# Altium schematic sheet 2CH_PM_Simulator.SchDoc: Title
size 420 x 297 mm; EDA_Number: ARTIQ; Author: G.Kasprowicz; CompanyName: WUT ISE; DrawnBy: G.Kasprowicz; Organization: WUT ISE; Address1: PW ISE; Address2: Nowowiejska 15/19 00-665 Warsaw; Address3: gkasprow@gmail.com; Revision: 2; SheetNumber: -; SheetTotal: -; ModifiedBy: -; CheckedDate: -; Title2: Title 2; DivGrp: WUT ISE; Designer: G.Kasprowicz; ModifiedDate: -; ProjectName: Sensor Box
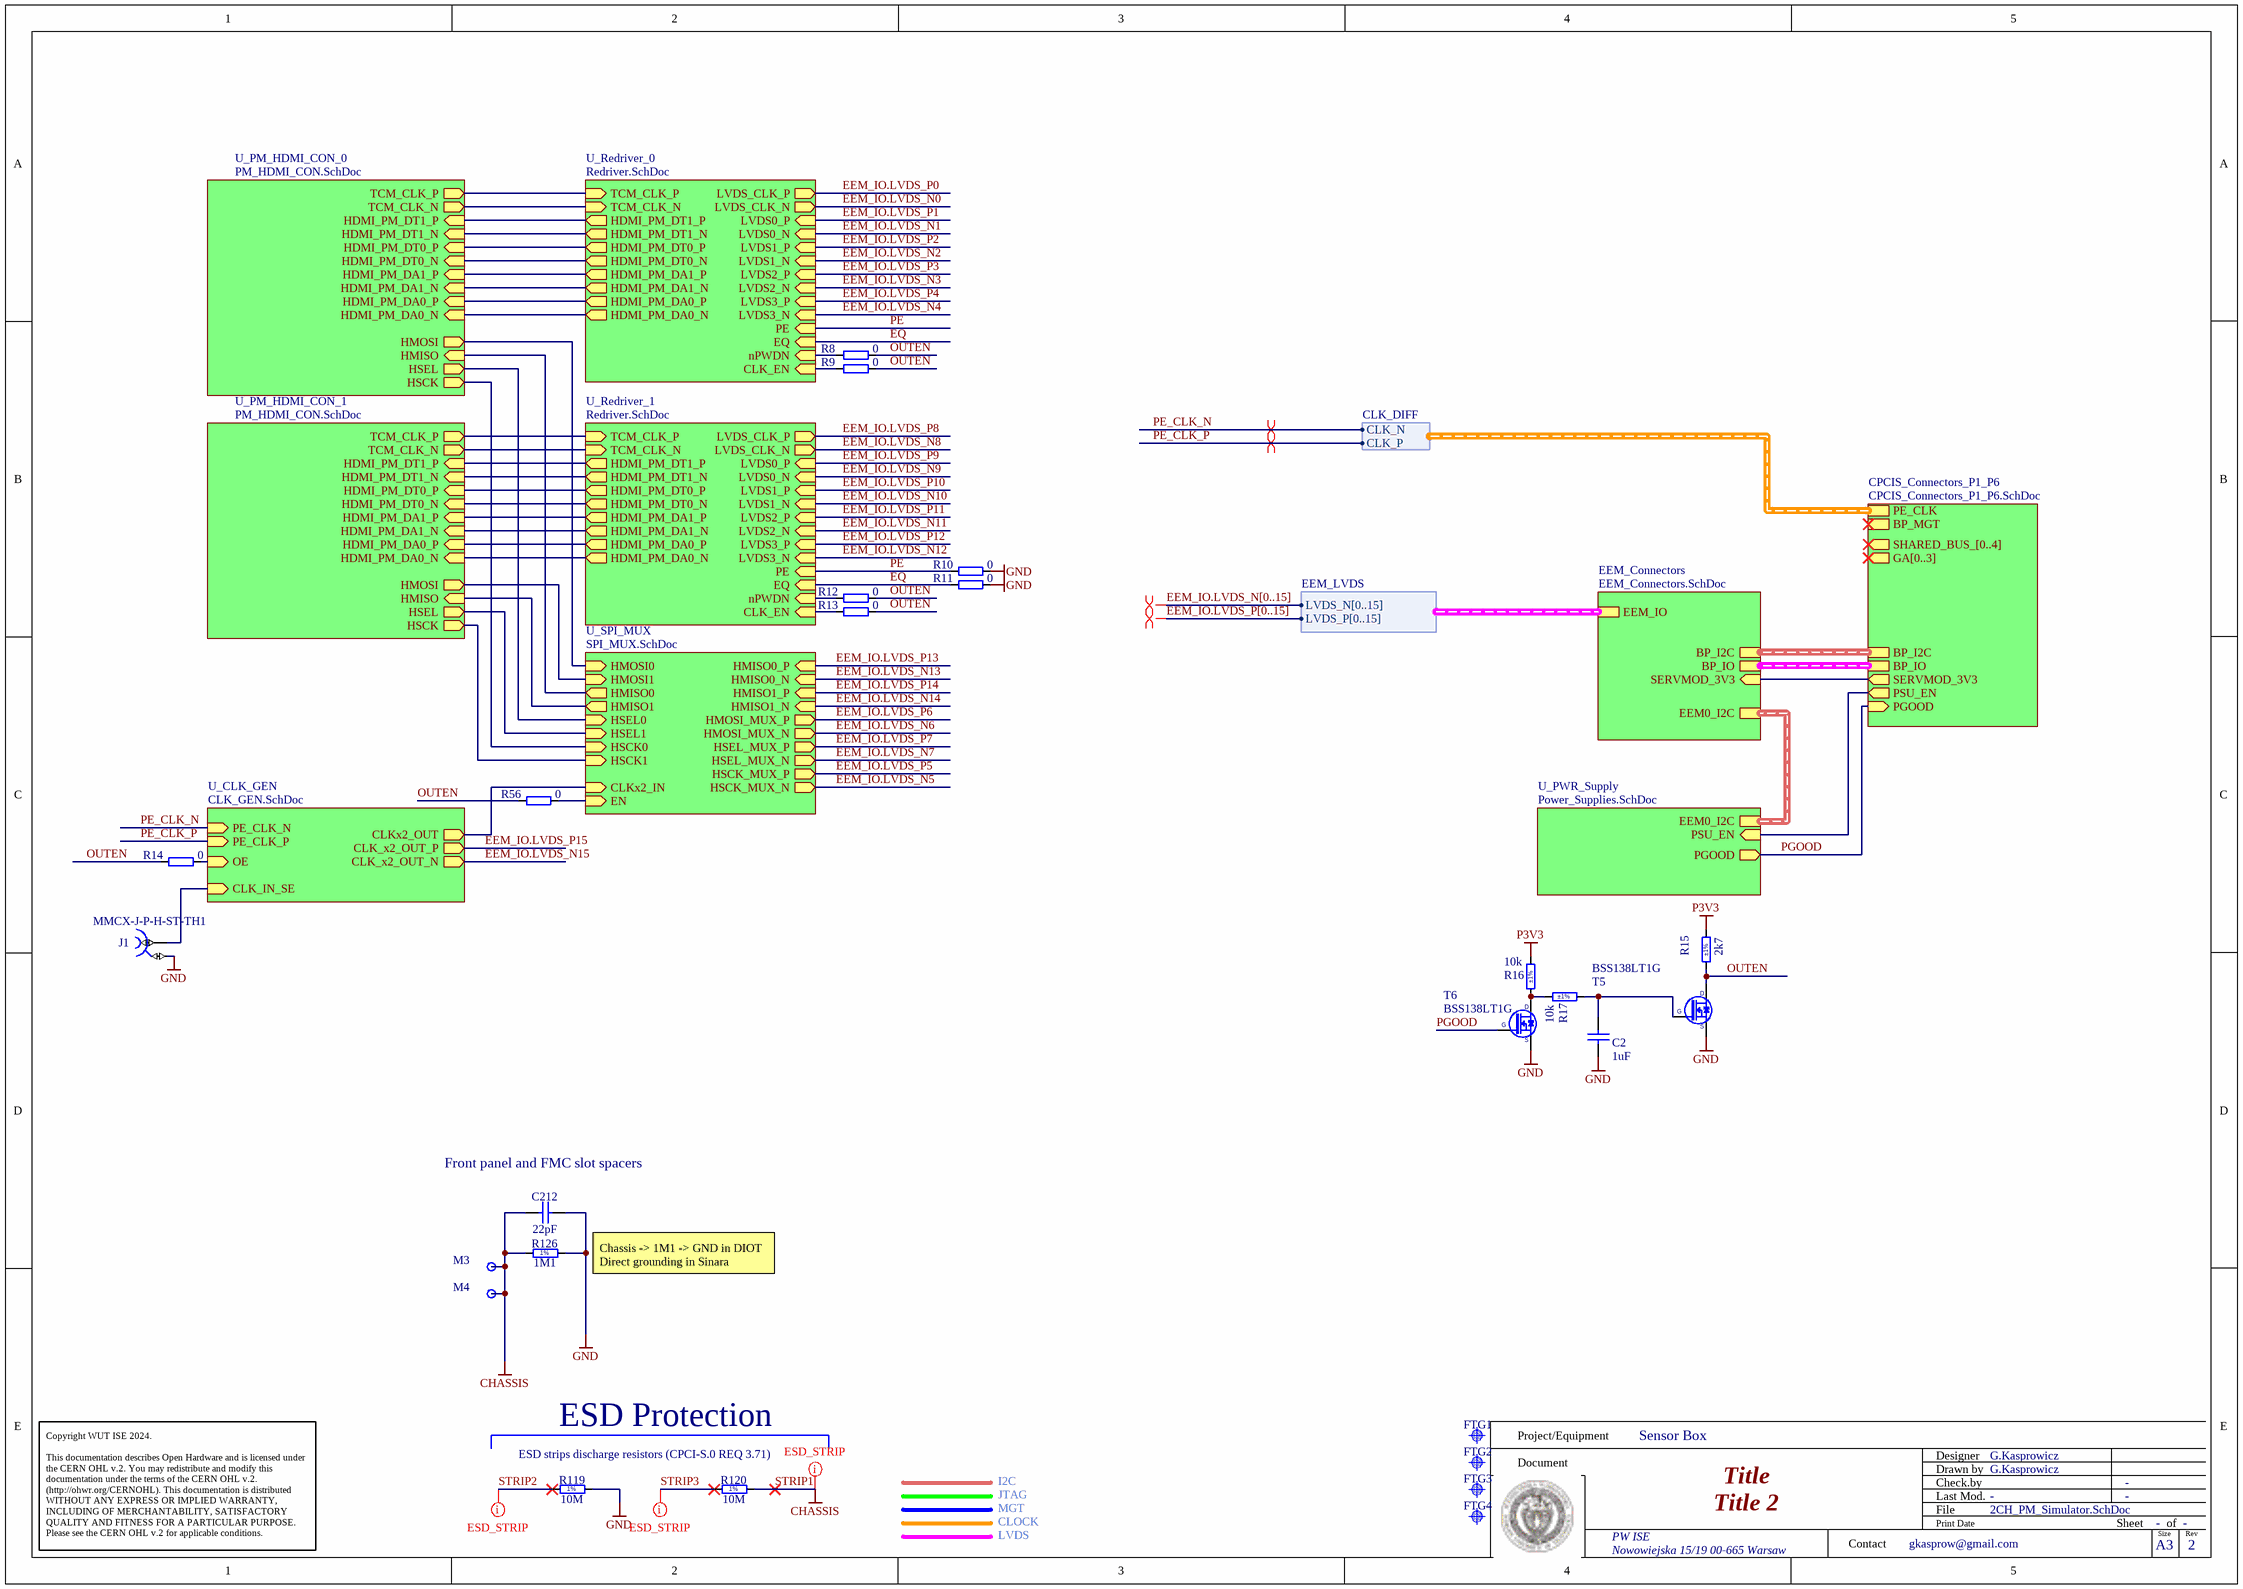
[diagram p0: 2CH_PM_Simulator.SchDoc]

## Parts
C2  1uF  [CAPC1608X87N]
C212  22pF  [CAPC1005X55N]
FTG1  Use only in PCB  [FIDUCIAL_TOP_C100-200]  (value not drawn)
FTG2  Use only in PCB  [FIDUCIAL_TOP_S100-200]  (value not drawn)
FTG3  Use only in PCB  [FIDUCIAL_TOP_S100-200]  (value not drawn)
FTG4  Use only in PCB  [FIDUCIAL_TOP_S100-200]  (value not drawn)
J1  Manufacturer Part Number: MMCX-J-P-H-ST-TH1  [SAMTEC_MMCX-J-P-H-ST-TH1]  (hidden comment: Coax_1Female_1Shield)
M3  Plated Hole  [MTG300_600]  (value not drawn)  (no BOM)
M4  Plated Hole  [MTG300_600]  (value not drawn)  (no BOM)
R8  0  [RESC1005X40N]
R9  0  [RESC1005X40N]
R10  0  [RESC1005X40N]
R11  0  [RESC1005X40N]
R12  0  [RESC1005X40N]
R13  0  [RESC1005X40N]
R14  0  [RESC1005X40N]
R15  2k7  Tolerance: ±1%  [RESC1608X55N]
R16  10k  Tolerance: ±1%  [RESC1608X55N]
R17  10k  Tolerance: ±1%  [RESC1608X55N]
R56  0  [RESC1005X40N]
R119  10M  [RESC2113X55N]
R120  10M  [RESC2113X55N]
R126  1M1  [RESC2012X60N]
T5  BSS138LT1G  [SOT95P240X110-3N]
T6  BSS138LT1G  [SOT95P240X110-3N]

## Sub-sheets
CPCIS_Connectors_P1_P6 = CPCIS_Connectors_P1_P6.SchDoc: BP_I2C (harness I2C), SERVMOD_3V3 (out), PSU_EN (out), PE_CLK (harness CLK_DIFF), BP_MGT (harness MGT), GA[0..3] (out), BP_IO (harness EEM_LVDS), SHARED_BUS_[0..4] (out), PGOOD (in)
EEM_Connectors = EEM_Connectors.SchDoc: EEM_IO (harness EEM_LVDS), BP_IO (harness EEM_LVDS), EEM0_I2C (harness I2C), BP_I2C (harness I2C), SERVMOD_3V3 (in)
U_CLK_GEN = CLK_GEN.SchDoc: PE_CLK_N (in), PE_CLK_P (in), CLKx2_OUT (out), CLK_x2_OUT_P (out), CLK_x2_OUT_N (out), OE (in), CLK_IN_SE (in)
U_PM_HDMI_CON_0 = PM_HDMI_CON.SchDoc: TCM_CLK_P (out), TCM_CLK_N (out), HDMI_PM_DT1_P (in), HDMI_PM_DT1_N (in), HDMI_PM_DT0_P (in), HDMI_PM_DT0_N (in), HDMI_PM_DA1_P (in), HDMI_PM_DA1_N (in), HDMI_PM_DA0_P (in), HDMI_PM_DA0_N (in), HSCK (out), HMISO (in), HSEL (out), HMOSI (out)
U_PM_HDMI_CON_1 = PM_HDMI_CON.SchDoc: TCM_CLK_P (out), TCM_CLK_N (out), HDMI_PM_DT1_P (in), HDMI_PM_DT1_N (in), HDMI_PM_DT0_P (in), HDMI_PM_DT0_N (in), HDMI_PM_DA1_P (in), HDMI_PM_DA1_N (in), HDMI_PM_DA0_P (in), HDMI_PM_DA0_N (in), HSCK (out), HMISO (in), HSEL (out), HMOSI (out)
U_PWR_Supply = Power_Supplies.SchDoc: PSU_EN (in), EEM0_I2C (harness I2C), PGOOD (out)
U_Redriver_0 = Redriver.SchDoc: HDMI_PM_DT1_P (out), HDMI_PM_DT1_N (out), HDMI_PM_DT0_P (out), HDMI_PM_DT0_N (out), HDMI_PM_DA1_P (out), HDMI_PM_DA1_N (out), HDMI_PM_DA0_P (out), HDMI_PM_DA0_N (out), LVDS0_P (in), LVDS0_N (in), LVDS1_P (in), LVDS1_N (in), LVDS2_P (in), LVDS2_N (in), LVDS3_P (in), LVDS3_N (in), TCM_CLK_P (in), TCM_CLK_N (in), LVDS_CLK_P (out), LVDS_CLK_N (out), PE (in), EQ (in), nPWDN (in), CLK_EN (in)
U_Redriver_1 = Redriver.SchDoc: HDMI_PM_DT1_P (out), HDMI_PM_DT1_N (out), HDMI_PM_DT0_P (out), HDMI_PM_DT0_N (out), HDMI_PM_DA1_P (out), HDMI_PM_DA1_N (out), HDMI_PM_DA0_P (out), HDMI_PM_DA0_N (out), LVDS0_P (in), LVDS0_N (in), LVDS1_P (in), LVDS1_N (in), LVDS2_P (in), LVDS2_N (in), LVDS3_P (in), LVDS3_N (in), TCM_CLK_P (in), TCM_CLK_N (in), LVDS_CLK_P (out), LVDS_CLK_N (out), PE (in), EQ (in), nPWDN (in), CLK_EN (in)
U_SPI_MUX = SPI_MUX.SchDoc: HMOSI0 (in), HMOSI1 (in), HMISO0 (out), HMISO1 (out), HSEL0 (in), HSEL1 (in), HSCK0 (in), HSCK1 (in), HMISO0_P (in), HMISO0_N (in), HMISO1_P (in), HMISO1_N (in), HMOSI_MUX_P (out), HMOSI_MUX_N (out), HSEL_MUX_P (out), HSEL_MUX_N (out), HSCK_MUX_P (out), HSCK_MUX_N (out), CLKx2_IN (in), EN (in)

## Harnesses
EEM_LVDS: LVDS_P[0..15], LVDS_N[0..15]
CLK_DIFF: CLK_N, CLK_P

## Nets
GND: C2.1 C212.2 J1.2 R10.2 R11.2 R119.2 R126.2 T5.2(S) T6.2(S)
P3V3: R15.2 R16.2
STRIP1: C212.1 M3.1 M4.1 R120.2 R126.1  [also labelled CHASSIS]
EEM_IO.LVDS_N0: sheet U_Redriver_0/LVDS_CLK_N
EEM_IO.LVDS_N1: sheet U_Redriver_0/LVDS0_N
EEM_IO.LVDS_N2: sheet U_Redriver_0/LVDS1_N
EEM_IO.LVDS_N3: sheet U_Redriver_0/LVDS2_N
EEM_IO.LVDS_N4: sheet U_Redriver_0/LVDS3_N
EEM_IO.LVDS_N5: sheet U_SPI_MUX/HSCK_MUX_N
EEM_IO.LVDS_N6: sheet U_SPI_MUX/HMOSI_MUX_N
EEM_IO.LVDS_N7: sheet U_SPI_MUX/HSEL_MUX_N
EEM_IO.LVDS_N8: sheet U_Redriver_1/LVDS_CLK_N
EEM_IO.LVDS_N9: sheet U_Redriver_1/LVDS0_N
EEM_IO.LVDS_N10: sheet U_Redriver_1/LVDS1_N
EEM_IO.LVDS_N11: sheet U_Redriver_1/LVDS2_N
EEM_IO.LVDS_N12: sheet U_Redriver_1/LVDS3_N
EEM_IO.LVDS_N13: sheet U_SPI_MUX/HMISO0_N
EEM_IO.LVDS_N14: sheet U_SPI_MUX/HMISO1_N
EEM_IO.LVDS_N15: sheet U_CLK_GEN/CLK_x2_OUT_N
EEM_IO.LVDS_P0: sheet U_Redriver_0/LVDS_CLK_P
EEM_IO.LVDS_P1: sheet U_Redriver_0/LVDS0_P
EEM_IO.LVDS_P2: sheet U_Redriver_0/LVDS1_P
EEM_IO.LVDS_P3: sheet U_Redriver_0/LVDS2_P
EEM_IO.LVDS_P4: sheet U_Redriver_0/LVDS3_P
EEM_IO.LVDS_P5: sheet U_SPI_MUX/HSCK_MUX_P
EEM_IO.LVDS_P6: sheet U_SPI_MUX/HMOSI_MUX_P
EEM_IO.LVDS_P7: sheet U_SPI_MUX/HSEL_MUX_P
EEM_IO.LVDS_P8: sheet U_Redriver_1/LVDS_CLK_P
EEM_IO.LVDS_P9: sheet U_Redriver_1/LVDS0_P
EEM_IO.LVDS_P10: sheet U_Redriver_1/LVDS1_P
EEM_IO.LVDS_P11: sheet U_Redriver_1/LVDS2_P
EEM_IO.LVDS_P12: sheet U_Redriver_1/LVDS3_P
EEM_IO.LVDS_P13: sheet U_SPI_MUX/HMISO0_P
EEM_IO.LVDS_P14: sheet U_SPI_MUX/HMISO1_P
EEM_IO.LVDS_P15: sheet U_CLK_GEN/CLK_x2_OUT_P
EQ: R11.1 ; sheet U_Redriver_0/EQ, sheet U_Redriver_1/EQ
OUTEN: R8.2 R9.2 R12.2 R13.2 R14.1 R15.1 R56.1 T5.3(D)
PE: R10.1 ; sheet U_Redriver_0/PE, sheet U_Redriver_1/PE
PE_CLK_N: sheet U_CLK_GEN/PE_CLK_N, sheet CPCIS_Connectors_P1_P6/PE_CLK.CLK_N
PE_CLK_P: sheet U_CLK_GEN/PE_CLK_P, sheet CPCIS_Connectors_P1_P6/PE_CLK.CLK_P
PGOOD: T6.1(G) ; sheet U_PWR_Supply/PGOOD, sheet CPCIS_Connectors_P1_P6/PGOOD
STRIP2: R119.1
STRIP3: R120.1
NetC2_2: C2.2 R17.1 T5.1(G)
NetJ1_1: J1.1 ; sheet U_CLK_GEN/CLK_IN_SE
NetR8_1: R8.1 ; sheet U_Redriver_0/nPWDN
NetR9_1: R9.1 ; sheet U_Redriver_0/CLK_EN
NetR12_1: R12.1 ; sheet U_Redriver_1/nPWDN
NetR13_1: R13.1 ; sheet U_Redriver_1/CLK_EN
NetR14_2: R14.2 ; sheet U_CLK_GEN/OE
NetR16_1: R16.1 R17.2 T6.3(D)
NetR56_2: R56.2 ; sheet U_SPI_MUX/EN
(unnamed): sheet U_PWR_Supply/PSU_EN, sheet CPCIS_Connectors_P1_P6/PSU_EN
(unnamed): sheet CPCIS_Connectors_P1_P6/SERVMOD_3V3, sheet EEM_Connectors/SERVMOD_3V3
(unnamed): sheet U_PM_HDMI_CON_0/TCM_CLK_P, sheet U_Redriver_0/TCM_CLK_P
(unnamed): sheet U_PM_HDMI_CON_0/TCM_CLK_N, sheet U_Redriver_0/TCM_CLK_N
(unnamed): sheet U_PM_HDMI_CON_0/HDMI_PM_DT1_P, sheet U_Redriver_0/HDMI_PM_DT1_P
(unnamed): sheet U_PM_HDMI_CON_0/HDMI_PM_DT1_N, sheet U_Redriver_0/HDMI_PM_DT1_N
(unnamed): sheet U_PM_HDMI_CON_0/HDMI_PM_DT0_P, sheet U_Redriver_0/HDMI_PM_DT0_P
(unnamed): sheet U_PM_HDMI_CON_0/HDMI_PM_DT0_N, sheet U_Redriver_0/HDMI_PM_DT0_N
(unnamed): sheet U_PM_HDMI_CON_0/HDMI_PM_DA1_P, sheet U_Redriver_0/HDMI_PM_DA1_P
(unnamed): sheet U_PM_HDMI_CON_0/HDMI_PM_DA1_N, sheet U_Redriver_0/HDMI_PM_DA1_N
(unnamed): sheet U_PM_HDMI_CON_0/HDMI_PM_DA0_P, sheet U_Redriver_0/HDMI_PM_DA0_P
(unnamed): sheet U_PM_HDMI_CON_0/HDMI_PM_DA0_N, sheet U_Redriver_0/HDMI_PM_DA0_N
(unnamed): sheet U_PM_HDMI_CON_0/HSCK, sheet U_SPI_MUX/HSCK0
(unnamed): sheet U_PM_HDMI_CON_0/HMISO, sheet U_SPI_MUX/HMISO0
(unnamed): sheet U_PM_HDMI_CON_0/HSEL, sheet U_SPI_MUX/HSEL0
(unnamed): sheet U_PM_HDMI_CON_0/HMOSI, sheet U_SPI_MUX/HMOSI0
(unnamed): sheet U_SPI_MUX/HMOSI1, sheet U_PM_HDMI_CON_1/HMOSI
(unnamed): sheet U_SPI_MUX/HMISO1, sheet U_PM_HDMI_CON_1/HMISO
(unnamed): sheet U_SPI_MUX/HSEL1, sheet U_PM_HDMI_CON_1/HSEL
(unnamed): sheet U_SPI_MUX/HSCK1, sheet U_PM_HDMI_CON_1/HSCK
(unnamed): sheet U_SPI_MUX/CLKx2_IN, sheet U_CLK_GEN/CLKx2_OUT
(unnamed): sheet U_PM_HDMI_CON_1/TCM_CLK_P, sheet U_Redriver_1/TCM_CLK_P
(unnamed): sheet U_PM_HDMI_CON_1/TCM_CLK_N, sheet U_Redriver_1/TCM_CLK_N
(unnamed): sheet U_PM_HDMI_CON_1/HDMI_PM_DT1_P, sheet U_Redriver_1/HDMI_PM_DT1_P
(unnamed): sheet U_PM_HDMI_CON_1/HDMI_PM_DT1_N, sheet U_Redriver_1/HDMI_PM_DT1_N
(unnamed): sheet U_PM_HDMI_CON_1/HDMI_PM_DT0_P, sheet U_Redriver_1/HDMI_PM_DT0_P
(unnamed): sheet U_PM_HDMI_CON_1/HDMI_PM_DT0_N, sheet U_Redriver_1/HDMI_PM_DT0_N
(unnamed): sheet U_PM_HDMI_CON_1/HDMI_PM_DA1_P, sheet U_Redriver_1/HDMI_PM_DA1_P
(unnamed): sheet U_PM_HDMI_CON_1/HDMI_PM_DA1_N, sheet U_Redriver_1/HDMI_PM_DA1_N
(unnamed): sheet U_PM_HDMI_CON_1/HDMI_PM_DA0_P, sheet U_Redriver_1/HDMI_PM_DA0_P
(unnamed): sheet U_PM_HDMI_CON_1/HDMI_PM_DA0_N, sheet U_Redriver_1/HDMI_PM_DA0_N

## Buses and harness runs
bus EEM_IO.LVDS_N[0..15]
bus EEM_IO.LVDS_P[0..15]
harness sheet CPCIS_Connectors_P1_P6/BP_I2C = sheet EEM_Connectors/BP_I2C
harness sheet CPCIS_Connectors_P1_P6/BP_IO = sheet EEM_Connectors/BP_IO
harness sheet EEM_Connectors/EEM0_I2C = sheet U_PWR_Supply/EEM0_I2C

## Layout directives
net class ESD_STRIP: STRIP1, STRIP2, STRIP3
differential pair; differential pair class Diff_100Ohm: (no net found under the mark), PE_CLK_N, PE_CLK_P

## Notes on the sheet
- (near C212) Front panel and FMC slot spacers
- Chassis -> 1M1 -> GND in DIOT
  Direct grounding in Sinara
- ESD strips discharge resistors (CPCI-S.0 REQ 3.71)
- ESD Protection
- I2C
- JTAG
- MGT
- CLOCK
- LVDS
- Project/Equipment
- Document
- Designer
- Drawn by
- Check.by
- Copyright WUT ISE 2024.
  This documentation describes Open Hardware and is licensed under the CERN OHL v.2. You may redistribute and modify this documentation under the terms of the CERN OHL v.2. (http://ohwr.org/CERNOHL). This documentation is distributed WITHOUT ANY EXPRESS OR IMPLIED WARRANTY, INCLUDING OF MERCHANTABILITY, SATISFACTORY QUALITY AND FITNESS FOR A PARTICULAR PURPOSE. Please see the CERN OHL v.2 for applicable conditions.
- Contact
- File
- Last Mod.
- Print Date
- Sheet
- Size
- A3
- of
- Rev
- (in symbol R0805_1M1_1%_0.125W_100PPM) 1%
- (in symbol R0805_10M_1%_0.125W_100PPM_VISHAY_CRCW e3) 1%

## Library data of the parts
C2 = CC0603_1UF_25V_10%_X7R: Non-polarised capacitor; Part Description: SMD Multilayer Chip Ceramic Capacitor; Manufacturer: GENERIC; Manufacturer1 Part Number: GRM188R71E105KA12D; Voltage: 25V; TC: X7R; Tolerance: ±10%; Part Number: CC0603_1UF_25V_10%_X7R; Component Kind: Standard; Component Type: Standard; Pin Count: 2; Value: 1uF; Status: None; Manufacturer Part Number: CC0603_1UF_25V_10%_X7R; Case: 0603; Mounted: Yes; Socket: No; SMD: Yes; Sense: No; Manufacturer1 Example: MURATA; Manufacturer1 ComponentHeight: 0.9mm; HelpURL: \\cern.ch\dfs\Applications\Altium\Datasheets\CC0603_X7R_MURATA.pdf; Author: CERN DEM JLC; CreateDate: 18.01.2011; LatestRevisionDate: 18.01.2011
C212 = CC0402_22PF_50V_5%_C0G: Non-polarised capacitor; Part Description: SMD Multilayer Chip Ceramic Capacitor; Manufacturer: GENERIC; Manufacturer1 Part Number: C0402C220J5GACTU; Voltage: 50V; TC: C0G/NP0; Tolerance: ±5%; Part Number: CC0402_22PF_50V_5%_C0G; Component Kind: Standard; Component Type: Standard; Pin Count: 2; Value: 22pF; Status: Preferred; Manufacturer Part Number: CC0402_22PF_50V_5%_C0G; Case: 0402; Mounted: Yes; Socket: No; SMD: Yes; Manufacturer1 Example: KEMET; Manufacturer1 ComponentHeight: 0.55mm; HelpURL: \\cern.ch\dfs\Applications\Altium\Datasheets\CC0402_C0G_KEMET_(Commercial Grade).pdf; Author: CERN DEM JLC; CreateDate: 2007-12-03; LatestRevisionDate: 2007-12-03; Sense: No
FTG1 = FIDUCIAL_TARGET_C100-200: Fiducial Target; Part Description: Round Fiducial Target, Top Layer, 1.0mm, Top Solder 2.0mm, Keepout =2.0mm; Mounted: No; Part Number: FIDUCIAL_TARGET_C100-200; Component Kind: Standard (No BOM); Component Type: Standard (No BOM); Pin Count: 1; Family: Fiducial; Socket: No; SMD: Yes; Sense: No; Status: None; ComponentHeight: 0mm; HelpURL: Undefined; Author: CERN DEM JLC; CreateDate: 09.02.2010; LatestRevisionDate: 04.04.2012; PackageDescription: Round Fiducial Target, Top Layer, 1.0mm, Top Solder 2.0mm, Keepout =2.0mm
FTG2-FTG4 = FIDUCIAL_TARGET_S100-200: Fiducial Target; Part Description: Square Fiducial Target, Top Layer, 1.0mm, Top Solder 2.0mm, Keepout =2.0mm; Mounted: No; Part Number: FIDUCIAL_TARGET_S100-200; Component Kind: Standard (No BOM); Component Type: Standard (No BOM); Pin Count: 1; Family: Fiducial; Socket: No; SMD: Yes; Sense: No; Status: None; ComponentHeight: 0mm; HelpURL: Undefined; Author: CERN DEM JLC; CreateDate: 09.02.2010; LatestRevisionDate: 04.04.2012; PackageDescription: Square Fiducial Target, Top Layer, 1.0mm, Top Solder 2.0mm, Keepout =2.0mm
J1 = SAMTEC_MMCX-J-P-H-ST-TH1: Part Description: Straight Through-hole 50 Ohms Micro Mini RF Jack, MMCX Series; Manufacturer: SAMTEC; PressFit: No; Part Number: SAMTEC_MMCX-J-P-H-ST-TH1; Component Kind: Standard; Component Type: Standard; Pin Count: 2; Mounted: Yes; Socket: No; SMD: No; Sense: No; Status: None; ComponentHeight: 4.35mm; HelpURL: \\cern.ch\dfs\Applications\Altium\Datasheets\SAMTEC_MMCX-J-P-H-ST-TH1.pdf; Author: CERN DEM JLC; CreateDate: 05.12.2012; LatestRevisionDate: 05.12.2012
M3 M4 = PLATED_HOLE3.0_PAD6.0: Single Terminal Socket; Part Description: Plated Through Hole: Hole Dia.=3.0mm Pad Dia.=6.0mm; Mounted: No; Table: Pads; Part Number: PLATED_HOLE3.0_PAD6.0; Component Type: Standard (No BOM); Designator: Single Terminal Socket; Library Reference: Single Terminal Socket; Pin Count: 1; Family: Plated Hole; Socket: No; SMD: No; Status: None; ComponentHeight: 0mm; Author: CERN DEM JLC; CreateDate: 26.05.2008; LatestRevisionDate: 26.05.2008; PackageDescription: Plated Through Hole: Hole Dia.=3.0mm Pad Dia.=6.0mm
R8-R14 R56 = R0402_0R_JUMPER: Resistor; Part Description: 1A (0.05R Max DC Resistance) Zero Ohm Jumper; Manufacturer: GENERIC; Manufacturer1 Part Number: 232270591001L; PressFit: No; Part Number: R0402_0R_JUMPER; Component Kind: Standard; Component Type: Standard; Pin Count: 2; Value: 0; Status: Not Recommended; Manufacturer Part Number: R0402_0R_JUMPER; Case: 0402; Mounted: Yes; Sense: No; Socket: No; SMD: Yes; Manufacturer1 Example: YAGEO PHYCOMP; Manufacturer1 ComponentHeight: 0.4mm; HelpURL: \\cern.ch\dfs\Applications\Altium\Datasheets\R0402_Phycomp_RC0402.pdf; Author: CERN DEM JLC; CreateDate: 03.12.2007; LatestRevisionDate: 17.10.2012
R15 = R0603_2K7_1%_0.1W_100PPM: Resistor - 1%; Part Description: General Purpose Thick Film Chip Resistor; Manufacturer: GENERIC; Manufacturer1 Part Number: RC0603FR-072K7L; Power: 0.1W; TC: ±100ppm/°C; PressFit: No; Part Number: R0603_2K7_1%_0.1W_100PPM; Component Kind: Standard; Component Type: Standard; Pin Count: 2; Value: 2k7; Status: Preferred; Manufacturer Part Number: R0603_2K7_1%_0.1W_100PPM; Case: 0603; Mounted: Yes; Sense: No; Socket: No; SMD: Yes; Manufacturer1 Example: YAGEO PHYCOMP; Manufacturer1 ComponentHeight: 0.55mm; HelpURL: \\cern.ch\dfs\Applications\Altium\Datasheets\R0603_PHYCOMP_RC0603.pdf; Author: CERN DEM JLC; CreateDate: 02.05.2011; LatestRevisionDate: 02.05.2011
R16 R17 = R0603_10K_1%_0.1W_100PPM: Resistor - 1%; Part Description: General Purpose Thick Film Chip Resistor; Manufacturer: GENERIC; Manufacturer1 Part Number: NRC06F1002TRF; Power: 0.1W; TC: ±100ppm/°C; PressFit: No; Part Number: R0603_10K_1%_0.1W_100PPM; Component Kind: Standard; Component Type: Standard; Pin Count: 2; Value: 10k; Status: Preferred; Manufacturer Part Number: R0603_10K_1%_0.1W_100PPM; Case: 0603; Mounted: Yes; Sense: No; Socket: No; SMD: Yes; Manufacturer1 Example: NIC COMPONENT; Manufacturer1 ComponentHeight: 0.55mm; HelpURL: \\cern.ch\dfs\Applications\Altium\Datasheets\R0603_NIC_NRC.pdf; Author: CERN DEM JLC; CreateDate: 03.12.2007; LatestRevisionDate: 13.03.2008
R119 R120 = R0805_10M_1%_0.125W_100PPM_VISHAY_CRCW e3: Resistor - 1%; Part Description: 150V, Standard Thick Film Chip Resistor; Manufacturer: VISHAY DALE; Manufacturer Part Number: CRCW080510M0FKEA; Power: 0.125W; TC: ±100ppm/°C; PressFit: No; Part Number: R0805_10M_1%_0.125W_100PPM_VISHAY_CRCW e3; Component Kind: Standard; Component Type: Standard; Pin Count: 2; Value: 10M; Status: None; Tolerance: ±1%; Case: 0805; Mounted: Yes; Sense: No; Socket: No; SMD: Yes; ComponentHeight: 0.5mm; HelpURL: \\cern.ch\dfs\Applications\Altium\Datasheets\R0805_VISHAY_CRCW e3.pdf; Author: CERN DEM BC; CreateDate: 2019-11-12; LatestRevisionDate: 2019-11-12
R126 = R0805_1M1_1%_0.125W_100PPM: Resistor - 1%; Part Description: General Purpose Thick Film Chip Resistor; Manufacturer: GENERIC; Manufacturer1 Part Number: NRC10F1104TRF; PressFit: No; Part Number: R0805_1M1_1%_0.125W_100PPM; Component Kind: Standard; Component Type: Standard; Pin Count: 2; Value: 1M1; Status: Preferred; Manufacturer Part Number: R0805_1M1_1%_0.125W_100PPM; Case: 0805; Mounted: Yes; Sense: No; Socket: No; SMD: Yes; Manufacturer1 Example: NIC COMPONENT; Manufacturer1 ComponentHeight: 0.6mm; HelpURL: \\cern.ch\dfs\Applications\Altium\Datasheets\R0805_NIC_NRC.pdf; Author: CERN DEM JLC; CreateDate: 03/12/2007; LatestRevisionDate: 13/03/2008
T5 T6 = BSS138LT1G: N-CHANNEL MOSFET WITH DIODE; Part Description: 50V, 200mA N-Channel Enhancement Mode Field-Effect Transistor; Manufacturer: ON SEMICONDUCTOR; PressFit: No; Bonding: No; Part Number: BSS138LT1G; Component Kind: Standard; Component Type: Standard; Device: BSS138LT1G; PackageDescription: SOT23, 0.95mm Pitch; 3 Pin, 1.40mm W X 3.00mm L X 1.10mm H body, IPC Medium Density; Manufacturer Part Number: BSS138L; Pin Count: 3; Case: SOT23-3; Mounted: Yes; Socket: No; SMD: Yes; Sense: No; ComponentHeight: 1.11mm; HelpURL: \\cern.ch\dfs\Applications\Altium\Datasheets\BSS138LT1G.pdf; Author: CERN DEM JLC; CreateDate: 23.03.2009; LatestRevisionDate: 25.05.2022